# Altium schematic sheet V_Reg.SchDoc
size A4; SheetNumber: 2; SheetTotal: 3
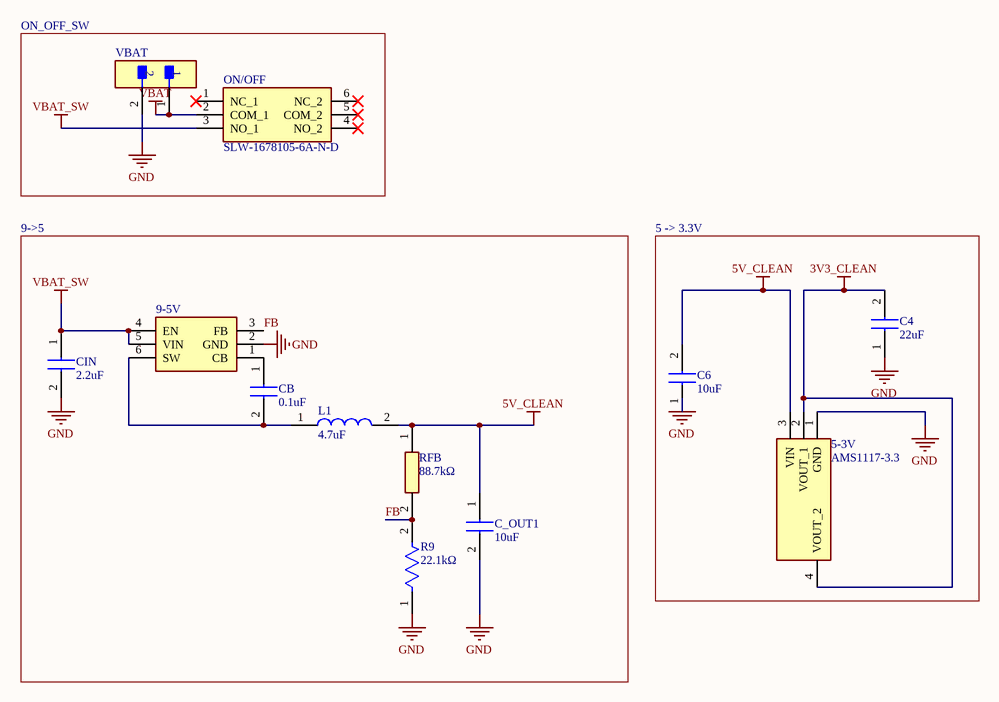
[diagram p0: V_Reg.SchDoc]

## Parts
5-3V  AMS1117-3.3  [SOT229P700X180-4N]
9-5V  LMR50410Y5FQDBVRQ1  [SOT95P280X145-6N]  (value not drawn)
C4  22uF  [CAPC1608X105N]
C6  10uF  [CAPC3216X180N]
C_OUT1  10uF  [CAPC2012X140N]
CB  0.1uF  [CAPC1608X90N]
CIN  2.2uF  [CAPC1608X90N]
L1  4.7uF  [621767970]
ON/OFF  SLW-1678105-6A-N-D  [SLW16781056AND]
R9  22.1kΩ  [FP-RT0603-MFG]
RFB  88.7kΩ  [ERA3AEB101V]
VBAT  837-22-002-30-001101  [FP-837-22-002-30-001101-MFG]  (value not drawn)

## Blocks framed on the sheet
ON_OFF_SW: ON/OFF VBAT
9->5: 9-5V C_OUT1 CB CIN L1 R9 RFB
5 -> 3.3V: 5-3V C4 C6

## Nets
3V3_CLEAN: 5-3V.2(VOUT_1) 5-3V.4(VOUT_2) C4.2
5V_CLEAN: 5-3V.3(VIN) C6.2 C_OUT1.1 L1.2 RFB.1
GND: 5-3V.1(GND) 9-5V.2(GND) C4.1 C6.1 C_OUT1.2 CIN.2 R9.1 VBAT.2
VBAT: ON/OFF.2(COM_1) VBAT.1
VBAT_SW: 9-5V.4(EN) 9-5V.5(VIN) CIN.1 ON/OFF.3(NO_1)
FB: 9-5V.3(FB) R9.2 RFB.2
Net9-5V_1: 9-5V.1(CB) CB.1
Net9-5V_6: 9-5V.6(SW) CB.2 L1.1

Not connected (* = marked no-connect by the designer): ON/OFF 1(NC_1)* 4(NO_2)* 5(COM_2)* 6(NC_2)*

## Library data of the parts
5-3V = AMS1117-3.3: Integrated Circuit; Manufacturer_Name: Advanced Monolithic Systems; Datasheet Link: http://www.advanced-monolithic.com/pdf/ds1117.pdf; Height: 1.8mm; Manufacturer_Part_Number: AMS1117-3.3
9-5V = LMR50410Y5FQDBVRQ1: Integrated Circuit; Manufacturer_Name: Texas Instruments; Datasheet Link: https://www.ti.com/lit/ds/symlink/lmr50410-q1.pdf; Height: 1.45mm; Manufacturer_Part_Number: LMR50410Y5FQDBVRQ1; Mouser Part Number: 595-R50410Y5FQDBVRQ1; Mouser Price/Stock: https://www.mouser.co.uk/ProductDetail/Texas-Instruments/LMR50410Y5FQDBVRQ1?qs=81r%252BiQLm7BR57cLsTbTr9w%3D%3D; Arrow Part Number: LMR50410Y5FQDBVRQ1; Arrow Price/Stock: https://www.arrow.com/en/products/lmr50410y5fqdbvrq1/texas-instruments?utm_currency=USD&region=nac
C4 = CL10A226MP8NUNE: Capacitor; Manufacturer_Name: SAMSUNG; Datasheet Link: https://datasheet.datasheetarchive.com/originals/distributors/Datasheets-DGA10/2407063.pdf; Height: 1.05mm; Manufacturer_Part_Number: CL10A226MP8NUNE; Mouser Part Number: 187-CL10A226MP8NUNE; Mouser Price/Stock: https://www.mouser.co.uk/ProductDetail/Samsung-Electro-Mechanics/CL10A226MP8NUNE?qs=gRKWieUq2Hb5O0PTfRKzDQ%3D%3D; Arrow Part Number: CL10A226MP8NUNE; Arrow Price/Stock: https://www.arrow.com/en/products/cl10a226mp8nune/samsung-electro-mechanics?utm_currency=USD&region=europe
C6 = CL31B106KAHNNNE: Capacitor; Manufacturer_Name: SAMSUNG; Datasheet Link: https://datasheet.datasheetarchive.com/originals/distributors/Datasheets_SAMA/d94547340e0e9d2be5f415b64e4e2f0a.pdf; Height: 1.8mm; Manufacturer_Part_Number: CL31B106KAHNNNE; Mouser Part Number: 187-CL31B106KAHNNNE; Mouser Price/Stock: https://www.mouser.co.uk/ProductDetail/Samsung-Electro-Mechanics/CL31B106KAHNNNE?qs=349EhDEZ59r5EZhnLOTsYA%3D%3D; Arrow Part Number: CL31B106KAHNNNE; Arrow Price/Stock: https://www.arrow.com/en/products/cl31b106kahnnne/samsung-electro-mechanics?utm_currency=USD&region=europe
C_OUT1 = CL21B106KOQNNNE: Capacitor; Manufacturer_Name: SAMSUNG; Datasheet Link: https://datasheet.datasheetarchive.com/originals/distributors/Datasheets_SAMA/a6a503886ec2e900bbf4e5d6e2f8e8b0.pdf; Height: 1.4mm; Manufacturer_Part_Number: CL21B106KOQNNNE; Mouser Part Number: 187-CL21B106KOQNNNE; Mouser Price/Stock: https://www.mouser.co.uk/ProductDetail/Samsung-Electro-Mechanics/CL21B106KOQNNNE?qs=349EhDEZ59r8qgLddyW2Yw%3D%3D; Arrow Part Number: CL21B106KOQNNNE; Arrow Price/Stock: https://www.arrow.com/en/products/cl21b106koqnnne/samsung-electro-mechanics?utm_currency=USD&region=europe
CB = CC0603KRX7R7BB104: Capacitor; Manufacturer_Name: YAGEO; Datasheet Link: https://www.yageo.com/en/Chart/Download/pdf/CC0603KRX7R7BB104; Height: 0.9mm; Manufacturer_Part_Number: CC0603KRX7R7BB104; Mouser Part Number: 603-CC603KRX7R7BB104; Mouser Price/Stock: https://www.mouser.co.uk/ProductDetail/YAGEO/CC0603KRX7R7BB104?qs=AgBp2OyFlx8KPmNTlFoWXA%3D%3D; Arrow Part Number: CC0603KRX7R7BB104; Arrow Price/Stock: https://www.arrow.com/en/products/cc0603krx7r7bb104/yageo?utm_currency=USD&region=europe
CIN = CL10A225KO8NNNC: Capacitor; Manufacturer_Name: SAMSUNG; Datasheet Link: https://lcsc.componentsearchengine.com/Datasheets/2/CL10A225KO8NNNC.pdf; Height: 0.9mm; Manufacturer_Part_Number: CL10A225KO8NNNC; Mouser Part Number: 187-CL10A225KO8NNNC; Mouser Price/Stock: https://www.mouser.co.uk/ProductDetail/Samsung-Electro-Mechanics/CL10A225KO8NNNC?qs=hqM3L16%252BxlecoJxUp5hKOw%3D%3D; Arrow Part Number: CL10A225KO8NNNC; Arrow Price/Stock: https://www.arrow.com/en/products/cl10a225ko8nnnc/samsung-electro-mechanics?region=europe
L1 = 7-2176797-1: Inductor; Manufacturer_Name: TE Connectivity; Datasheet Link: https://www.te.com/commerce/DocumentDelivery/DDEController?Action=srchrtrv&DocNm=1773151-4&DocType=Data%20Sheet&DocLang=English&DocFormat=pdf&PartCntxt=2176797-45; Height: 1mm; Manufacturer_Part_Number: 7-2176797-1
ON/OFF = SLW-1678105-6A-N-D: Switch; Manufacturer_Name: Same Sky; Datasheet Link: https://www.sameskydevices.com/product/resource/SLW-1678105-6A-N-D.pdf; Height: 14.5mm; Manufacturer_Part_Number: SLW-1678105-6A-N-D; Mouser Part Number: 179-SLW16781056AND; Mouser Price/Stock: https://www.mouser.co.uk/ProductDetail/Same-Sky/SLW-1678105-6A-N-D?qs=IKkN%2F947nfCWfuHPg7jcWw%3D%3D; Arrow Part Number: SLW-1678105-6A-N-D; Arrow Price/Stock: https://www.arrow.com/en/products/slw-1678105-6a-n-d/cui-devices?utm_currency=USD&region=nac
R9 = CMP-2000-04404-2: RES 22.1K OHM 1/10W .1% SMD 0603; Manufacturer Part Number: RT0603BRD0722K1L; Manufacturer: Yageo; Voltage Rating: 75V; Power Rating: 0.1W; Temperature Coefficient: 25 ppm/°C; Tolerance: 0.001; Series: RT; Device Class L2: Resistors; Temperature: -55°C to +155°C; Lead Free: Yes; Composition: Thin Film; Device Class L3: Chip SMD Resistors; ComponentLink2Description: Datasheet; Footprint Url: http://www.yageo.com/exep/pages/download/literatures/PYu-R_Mount_10.pdf; Category: Res; Temperature Range High: +155°C; Automotive: No; Temperature Range Low: -55°C; RoHS: TRUE; Height: 0.55mm; Octopart: https://octopart.com/rt0603brd0722k1l-yageo-1430878; ComponentLink2URL: http://www.yageo.com/documents/recent/PYu-RT_1-to-0.01_RoHS_L_9.pdf; Digikey Description: RES 22.1K OHM 1/10W .1% SMD 0603; Device Class L1: Passive Components; Package: RT0603; Value: 22.1KΩ; Ipc Land Pattern Name: RESC16080X45; Resistance: 22.1KΩ; Mouser Description: Res Thin Film 0603 22.1K Ohm 0.1% 1/10W ±25ppm/°C SMD Paper T/R
RFB = ERA-3AEB8872V: Resistor; Manufacturer_Name: Panasonic; Datasheet Link: https://industrial.panasonic.com/cdbs/www-data/pdf/RDM0000/AOA0000C307.pdf; Height: 0.55mm; Manufacturer_Part_Number: ERA-3AEB8872V; Mouser Part Number: 667-ERA-3AEB8872V; Mouser Price/Stock: https://www.mouser.co.uk/ProductDetail/Panasonic/ERA-3AEB8872V?qs=nuXzIS8loXExOdAoV6n39Q%3D%3D; Arrow Part Number: ERA-3AEB8872V; Arrow Price/Stock: https://www.arrow.com/en/products/era-3aeb8872v/panasonic?region=nac
VBAT = CMP-07791-000013-1: CONN SPRING PISTON 2POS SMD; Manufacturer: Mill-Max; Pitch: 2.54mm; Current Rating: 2A; Standoff Height: 0.41mm; Conn Orientation: Vertical; Conn Gender: Male; Voltage Rating: 150V; Number Of Contacts: 2; Contact Material: Gold,Nickel; Package: 837-22-002-30-001101; ComponentLink2URL: https://www.mill-max.com/catalog/download/2019-08%3A009.1M.pdf; Device Class L1: Connectors; Height: 9.63mm; RoHS: TRUE; Device Class L2: Headers and Wire Housings; Digikey Description: CONN SPRING PISTON 2POS SMD; Number Of Rows: 1; Device Class L3: unset; Octopart: https://octopart.com/837-22-002-30-001101-mill-max-76383858; ComponentLink2Description: Datasheet; Automotive: No; Lead Free: No; Manufacturer Part Number: 837-22-002-30-001101; Category: Conn